# EAGLE schematic NT1X68BC (EAGLE 6.6.0)

## Sheet 1 of 5: I/O + Power
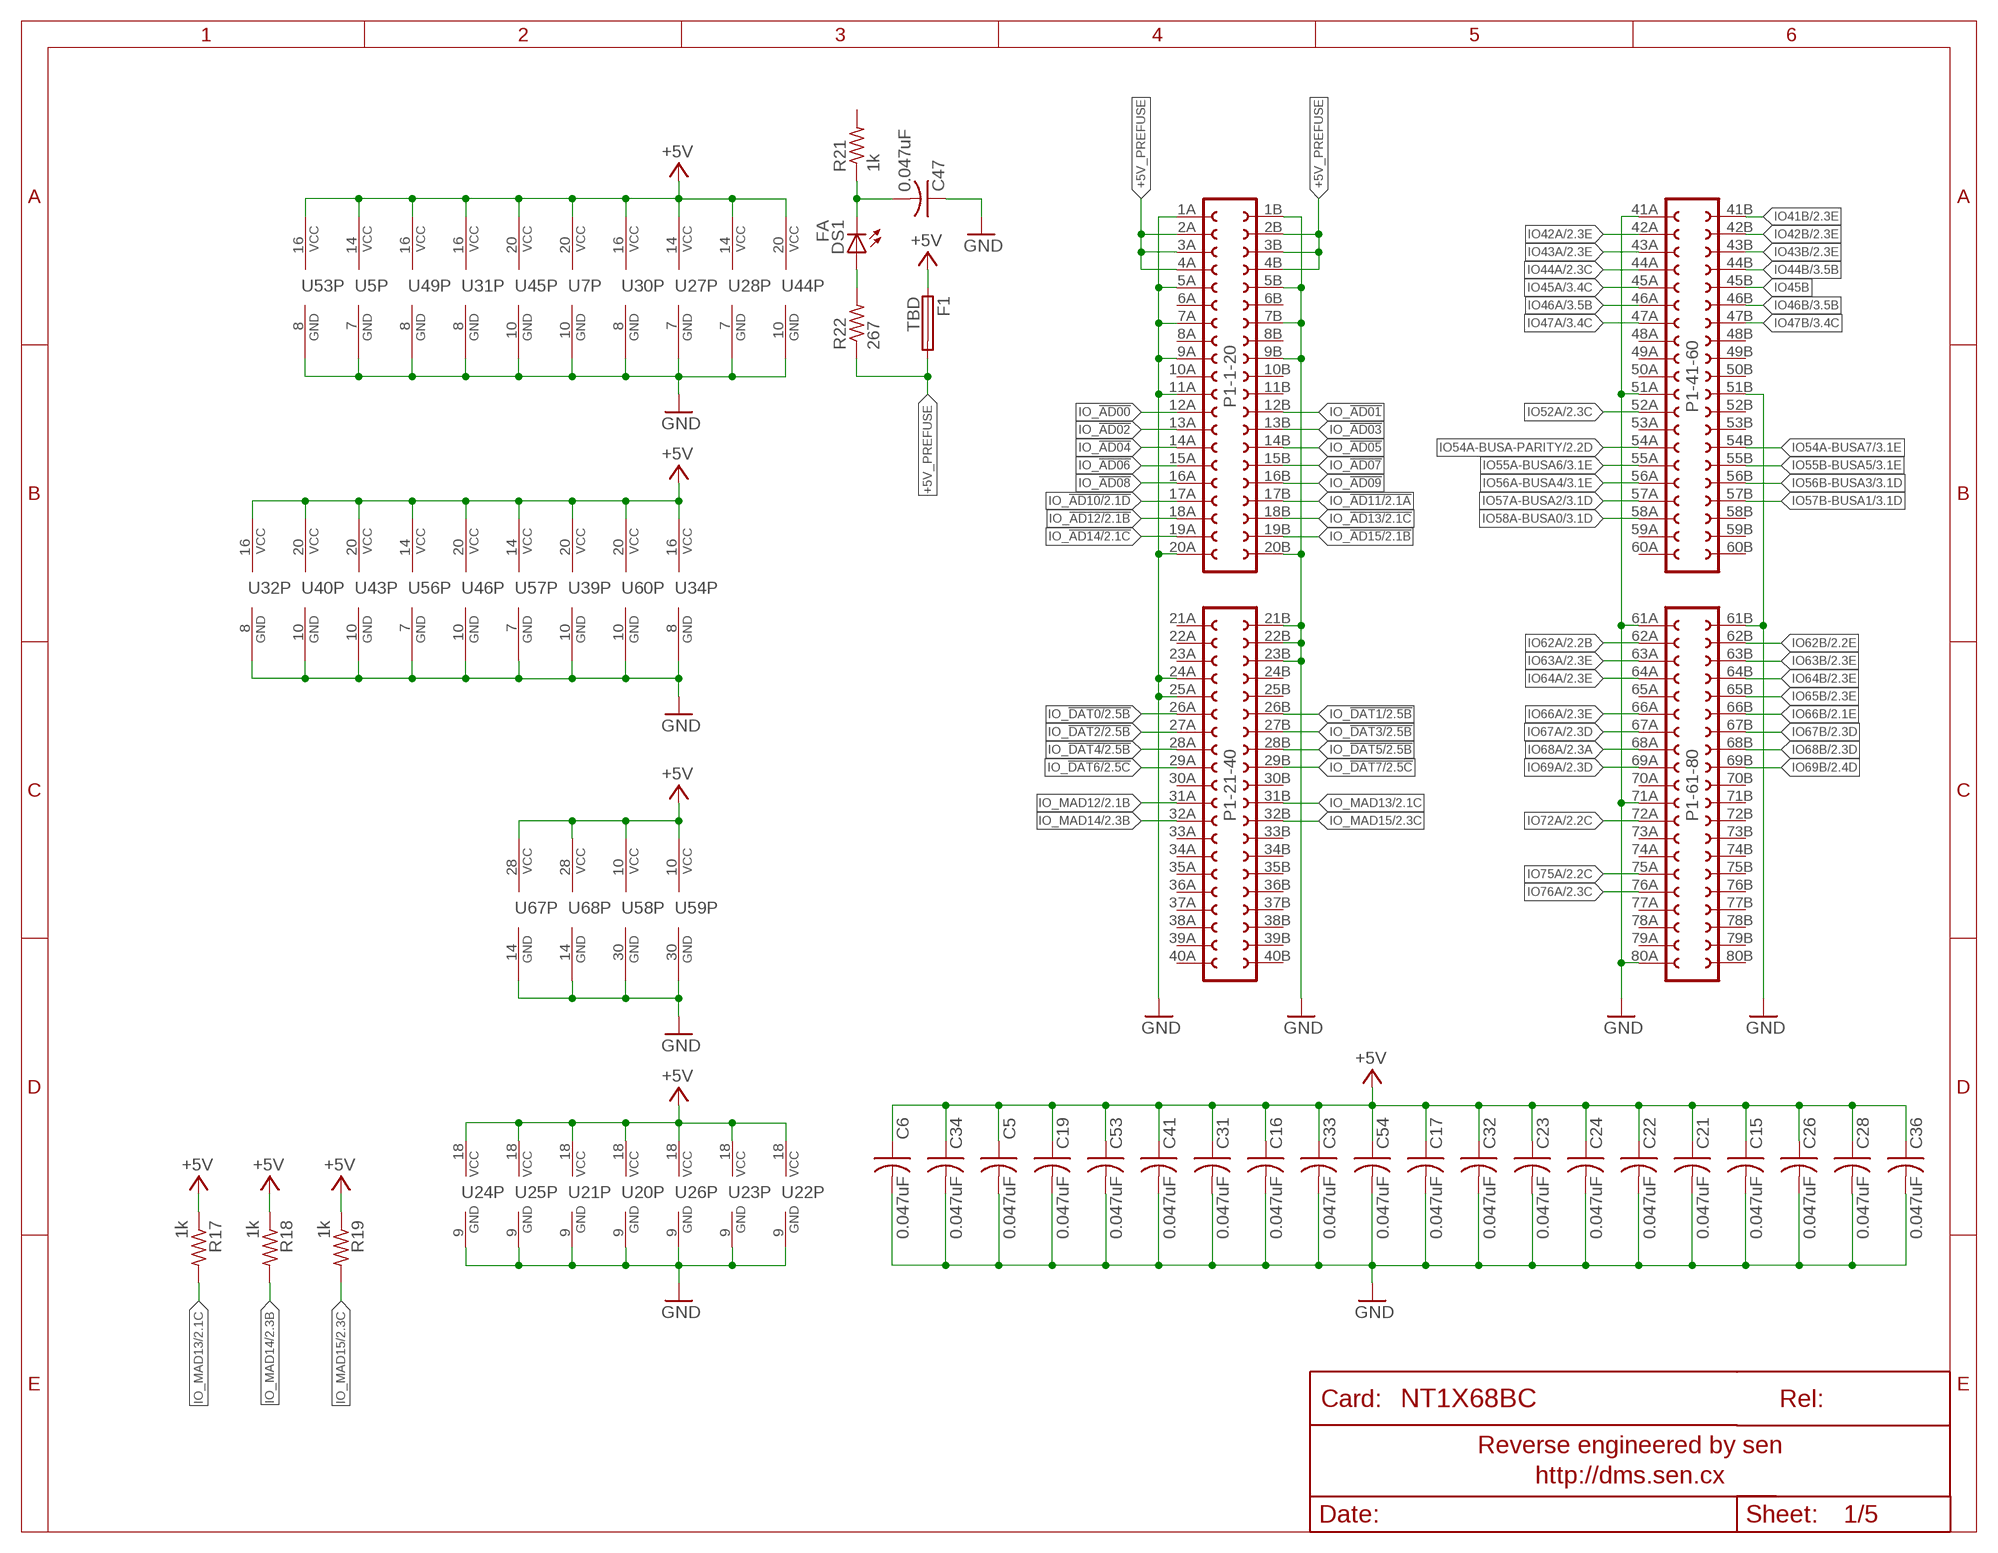
[diagram p0: schematic, sheet 1]
FRAME1 (FRAME-LETTER-GRID-DMS): REL: 04

### Parts
C5  0.047uF  C-US075-032X103  [C075-032X103]
C6  0.047uF  C-US075-032X103  [C075-032X103]
C15  0.047uF  C-US075-032X103  [C075-032X103]
C16  0.047uF  C-US075-032X103  [C075-032X103]
C17  0.047uF  C-US075-032X103  [C075-032X103]
C19  0.047uF  C-US075-032X103  [C075-032X103]
C21  0.047uF  C-US075-032X103  [C075-032X103]
C22  0.047uF  C-US075-032X103  [C075-032X103]
C23  0.047uF  C-US075-032X103  [C075-032X103]
C24  0.047uF  C-US075-032X103  [C075-032X103]
C26  0.047uF  C-US075-032X103  [C075-032X103]
C28  0.047uF  C-US075-032X103  [C075-032X103]
C31  0.047uF  C-US075-032X103  [C075-032X103]
C32  0.047uF  C-US075-032X103  [C075-032X103]
C33  0.047uF  C-US075-032X103  [C075-032X103]
C34  0.047uF  C-US075-032X103  [C075-032X103]
C36  0.047uF  C-US075-032X103  [C075-032X103]
C41  0.047uF  C-US075-032X103  [C075-032X103]
C47  0.047uF  C-US075-032X103  [C075-032X103]
C53  0.047uF  C-US075-032X103  [C075-032X103]
C54  0.047uF  C-US075-032X103  [C075-032X103]
DS1  FA  LED5MM  [LED5MM]
F1  TBD  LITTLEFUSE  [LITTLEFUSE]
P1  FE80-2W-HALFKEY  [FE80-2W-HALFKEY]
R17  1k  R-US_0207/12  [0207/12]
R18  1k  R-US_0207/12  [0207/12]
R19  1k  R-US_0207/12  [0207/12]
R21  1k  R-US_0207/12  [0207/12]
R22  267  R-US_0207/12  [0207/12]
U5  74LS14N  [DIL14]
U7  74LS374N  [DIL20]
U20  DM74S573  [DIL18]
U21  DM74S573  [DIL18]
U22  DM74S573  [DIL18]
U23  DM74S573  [DIL18]
U24  DM74S573  [DIL18]
U25  DM74S573  [DIL18]
U26  DM74S573  [DIL18]
U27  74LS136N  [DIL14]
U28  74LS136N  [DIL14]
U30  74LS257N  [DIL16]
U31  74LS257N  [DIL16]
U32  74LS257N  [DIL16]
U34  74LS257N  [DIL16]
U39  74LS374N  [DIL20]
U40  74LS374N  [DIL20]
U43  74LS240N  [DIL20]
U44  74LS240N  [DIL20]
U45  74LS240N  [DIL20]
U46  74LS240N  [DIL20]
U49  74LS109N  [DIL16]
U53  74LS138N  [DIL16]
U56  74F280N  74LS280N  [DIL14]
U57  74F280N  74LS280N  [DIL14]
U58  CY7C901  [DIL40]
U59  CY7C901  [DIL40]
U60  74LS241N  [DIL20]
U67  CY7C909  [DIL28-6]
U68  CY7C909  [DIL28-6]

### Nets
+5V: C5.1 C6.1 C15.1 C16.1 C17.1 C19.1 C21.1 C22.1 C23.1 C24.1 C26.1 C28.1 C31.1 C32.1 C33.1 C34.1 C36.1 C41.1 C53.1 C54.1 F1.1 R17.1 R18.1 R19.1 U5.14(P:VCC) U7.20(VCC) U20.18(VCC) U21.18(VCC) U22.18(VCC) U23.18(VCC) U24.18(VCC) U25.18(VCC) U26.18(VCC) U27.14(P:VCC) U28.14(P:VCC) U30.16(VCC) U31.16(VCC) U32.16(VCC) U34.16(VCC) U39.20(VCC) U40.20(VCC) U43.20(P:VCC) U44.20(P:VCC) U45.20(P:VCC) U46.20(P:VCC) U49.16(P:VCC) U53.16(VCC) U56.14(VCC) U57.14(VCC) U58.10(VCC) U59.10(VCC) U60.20(P:VCC) U67.28(VCC) U68.28(VCC) ; also sheet 2,4
+5V_PREFUSE: F1.2 P1.2A(-1-20:2A) P1.2B(-1-20:2B) P1.3A(-1-20:3A) P1.3B(-1-20:3B) P1.4A(-1-20:4A) P1.4B(-1-20:4B) R22.1
DS1-R21: C47.2 DS1.K(C) R21.1
GND: C5.2 C6.2 C15.2 C16.2 C17.2 C19.2 C21.2 C22.2 C23.2 C24.2 C26.2 C28.2 C31.2 C32.2 C33.2 C34.2 C36.2 C41.2 C47.1 C53.2 C54.2 P1.1A(-1-20:1A) P1.1B(-1-20:1B) P1.5A(-1-20:5A) P1.5B(-1-20:5B) P1.7A(-1-20:7A) P1.7B(-1-20:7B) P1.9A(-1-20:9A) P1.9B(-1-20:9B) P1.11A(-1-20:11A) P1.20A(-1-20:20A) P1.20B(-1-20:20B) P1.21B(-21-40:1B) P1.22B(-21-40:2B) P1.23B(-21-40:3B) P1.24A(-21-40:4A) P1.25A(-21-40:5A) P1.41A(-41-60:1A) P1.51A(-41-60:11A) P1.51B(-41-60:11B) P1.61A(-61-80:1A) P1.61B(-61-80:1B) P1.71A(-61-80:11A) P1.80A(-61-80:20A) U5.7(P:GND) U7.10(GND) U20.9(GND) U21.9(GND) U22.9(GND) U23.9(GND) U24.9(GND) U25.9(GND) U26.9(GND) U27.7(P:GND) U28.7(P:GND) U30.8(GND) U31.8(GND) U32.8(GND) U34.8(GND) U39.10(GND) U40.10(GND) U43.10(P:GND) U44.10(P:GND) U45.10(P:GND) U46.10(P:GND) U49.8(P:GND) U53.8(GND) U56.7(GND) U57.7(GND) U58.30(GND) U59.30(GND) U60.10(P:GND) U67.14(GND) U68.14(GND) ; also sheet 2,3,4,5
IO41B: P1.41B(-41-60:1B) ; also sheet 2
IO42A: P1.42A(-41-60:2A) ; also sheet 2
IO42B: P1.42B(-41-60:2B) ; also sheet 2
IO43A: P1.43A(-41-60:3A) ; also sheet 2
IO43B: P1.43B(-41-60:3B) ; also sheet 2
IO44A: P1.44A(-41-60:4A) ; also sheet 2
IO44B: P1.44B(-41-60:4B) ; also sheet 3
IO45A: P1.45A(-41-60:5A) ; also sheet 3
IO45B: P1.45B(-41-60:5B)
IO46A: P1.46A(-41-60:6A) ; also sheet 3
IO46B: P1.46B(-41-60:6B) ; also sheet 3
IO47A: P1.47A(-41-60:7A) ; also sheet 3
IO47B: P1.47B(-41-60:7B) ; also sheet 3
IO52A: P1.52A(-41-60:12A) ; also sheet 2
IO54A-BUSA7: P1.54B(-41-60:14B) ; also sheet 3
IO54A-BUSA-PARITY: P1.54A(-41-60:14A) ; also sheet 2,3
IO55A-BUSA6: P1.55A(-41-60:15A) ; also sheet 3
IO55B-BUSA5: P1.55B(-41-60:15B) ; also sheet 3
IO56A-BUSA4: P1.56A(-41-60:16A) ; also sheet 3
IO56B-BUSA3: P1.56B(-41-60:16B) ; also sheet 3
IO57A-BUSA2: P1.57A(-41-60:17A) ; also sheet 3
IO57B-BUSA1: P1.57B(-41-60:17B) ; also sheet 3
IO58A-BUSA0: P1.58A(-41-60:18A) ; also sheet 3
IO62A: P1.62A(-61-80:2A) ; also sheet 2
IO62B: P1.62B(-61-80:2B) ; also sheet 2
IO63A: P1.63A(-61-80:3A) ; also sheet 2,3
IO63B: P1.63B(-61-80:3B) ; also sheet 2,3
IO64A: P1.64A(-61-80:4A) ; also sheet 2,3
IO64B: P1.64B(-61-80:4B) ; also sheet 2,3
IO65B: P1.65B(-61-80:5B) ; also sheet 2,3
IO66A: P1.66A(-61-80:6A) ; also sheet 2,3
IO66B: P1.66B(-61-80:6B) ; also sheet 2,3
IO67A: P1.67A(-61-80:7A) ; also sheet 2
IO67B: P1.67B(-61-80:7B) ; also sheet 2
IO68A: P1.68A(-61-80:8A) ; also sheet 2
IO68B: P1.68B(-61-80:8B) ; also sheet 2
IO69A: P1.69A(-61-80:9A) ; also sheet 2
IO69B: P1.69B(-61-80:9B) ; also sheet 2
IO72A: P1.72A(-61-80:12A) ; also sheet 2
IO75A: P1.75A(-61-80:15A) ; also sheet 2
IO76A: P1.76A(-61-80:16A) ; also sheet 2
IO_!AD00: P1.12A(-1-20:12A)
IO_!AD01: P1.12B(-1-20:12B)
IO_!AD02: P1.13A(-1-20:13A)
IO_!AD03: P1.13B(-1-20:13B)
IO_!AD04: P1.14A(-1-20:14A)
IO_!AD05: P1.14B(-1-20:14B)
IO_!AD06: P1.15A(-1-20:15A)
IO_!AD07: P1.15B(-1-20:15B)
IO_!AD08: P1.16A(-1-20:16A)
IO_!AD09: P1.16B(-1-20:16B)
IO_!AD10: P1.17A(-1-20:17A) ; also sheet 2
IO_!AD11: P1.17B(-1-20:17B) ; also sheet 2
IO_!AD12: P1.18A(-1-20:18A) ; also sheet 2
IO_!AD13: P1.18B(-1-20:18B) ; also sheet 2
IO_!AD14: P1.19A(-1-20:19A) ; also sheet 2
IO_!AD15: P1.19B(-1-20:19B) ; also sheet 2
IO_!DAT0: P1.26A(-21-40:6A) ; also sheet 2
IO_!DAT1: P1.26B(-21-40:6B) ; also sheet 2
IO_!DAT2: P1.27A(-21-40:7A) ; also sheet 2
IO_!DAT3: P1.27B(-21-40:7B) ; also sheet 2
IO_!DAT4: P1.28A(-21-40:8A) ; also sheet 2
IO_!DAT5: P1.28B(-21-40:8B) ; also sheet 2
IO_!DAT6: P1.29A(-21-40:9A) ; also sheet 2
IO_!DAT7: P1.29B(-21-40:9B) ; also sheet 2
IO_MAD12: P1.31A(-21-40:11A) ; also sheet 2
IO_MAD13: P1.31B(-21-40:11B) R17.2 ; also sheet 2
IO_MAD14: P1.32A(-21-40:12A) R18.2 ; also sheet 2
IO_MAD15: P1.32B(-21-40:12B) R19.2 ; also sheet 2
R22_DS1: DS1.A R22.2
Unconnected: P1.6A(-1-20:6A) P1.6B(-1-20:6B) P1.8A(-1-20:8A) P1.8B(-1-20:8B) P1.10A(-1-20:10A) P1.10B(-1-20:10B) P1.11B(-1-20:11B) P1.21A(-21-40:1A) P1.22A(-21-40:2A) P1.23A(-21-40:3A) P1.24B(-21-40:4B) P1.25B(-21-40:5B) P1.30A(-21-40:10A) P1.30B(-21-40:10B) P1.33A(-21-40:13A) P1.33B(-21-40:13B) P1.34A(-21-40:14A) P1.34B(-21-40:14B) P1.35A(-21-40:15A) P1.35B(-21-40:15B) P1.36A(-21-40:16A) P1.36B(-21-40:16B) P1.37A(-21-40:17A) P1.37B(-21-40:17B) P1.38A(-21-40:18A) P1.38B(-21-40:18B) P1.39A(-21-40:19A) P1.39B(-21-40:19B) P1.40A(-21-40:20A) P1.40B(-21-40:20B) P1.48A(-41-60:8A) P1.48B(-41-60:8B) P1.49A(-41-60:9A) P1.49B(-41-60:9B) P1.50A(-41-60:10A) P1.50B(-41-60:10B) P1.52B(-41-60:12B) P1.53A(-41-60:13A) P1.53B(-41-60:13B) P1.58B(-41-60:18B) P1.59A(-41-60:19A) P1.59B(-41-60:19B) P1.60A(-41-60:20A) P1.60B(-41-60:20B) P1.65A(-61-80:5A) P1.70A(-61-80:10A) P1.70B(-61-80:10B) P1.71B(-61-80:11B) P1.72B(-61-80:12B) P1.73A(-61-80:13A) P1.73B(-61-80:13B) P1.74A(-61-80:14A) P1.74B(-61-80:14B) P1.75B(-61-80:15B) P1.76B(-61-80:16B) P1.77A(-61-80:17A) P1.77B(-61-80:17B) P1.78A(-61-80:18A) P1.78B(-61-80:18B) P1.79A(-61-80:19A) P1.79B(-61-80:19B) P1.80B(-61-80:20B) R21.2 U27.8(C:O) U27.9(C:I0) U27.10(C:I1) U27.11(D:O) U27.12(D:I0) U27.13(D:I1)

## Sheet 2 of 5: Logic 1
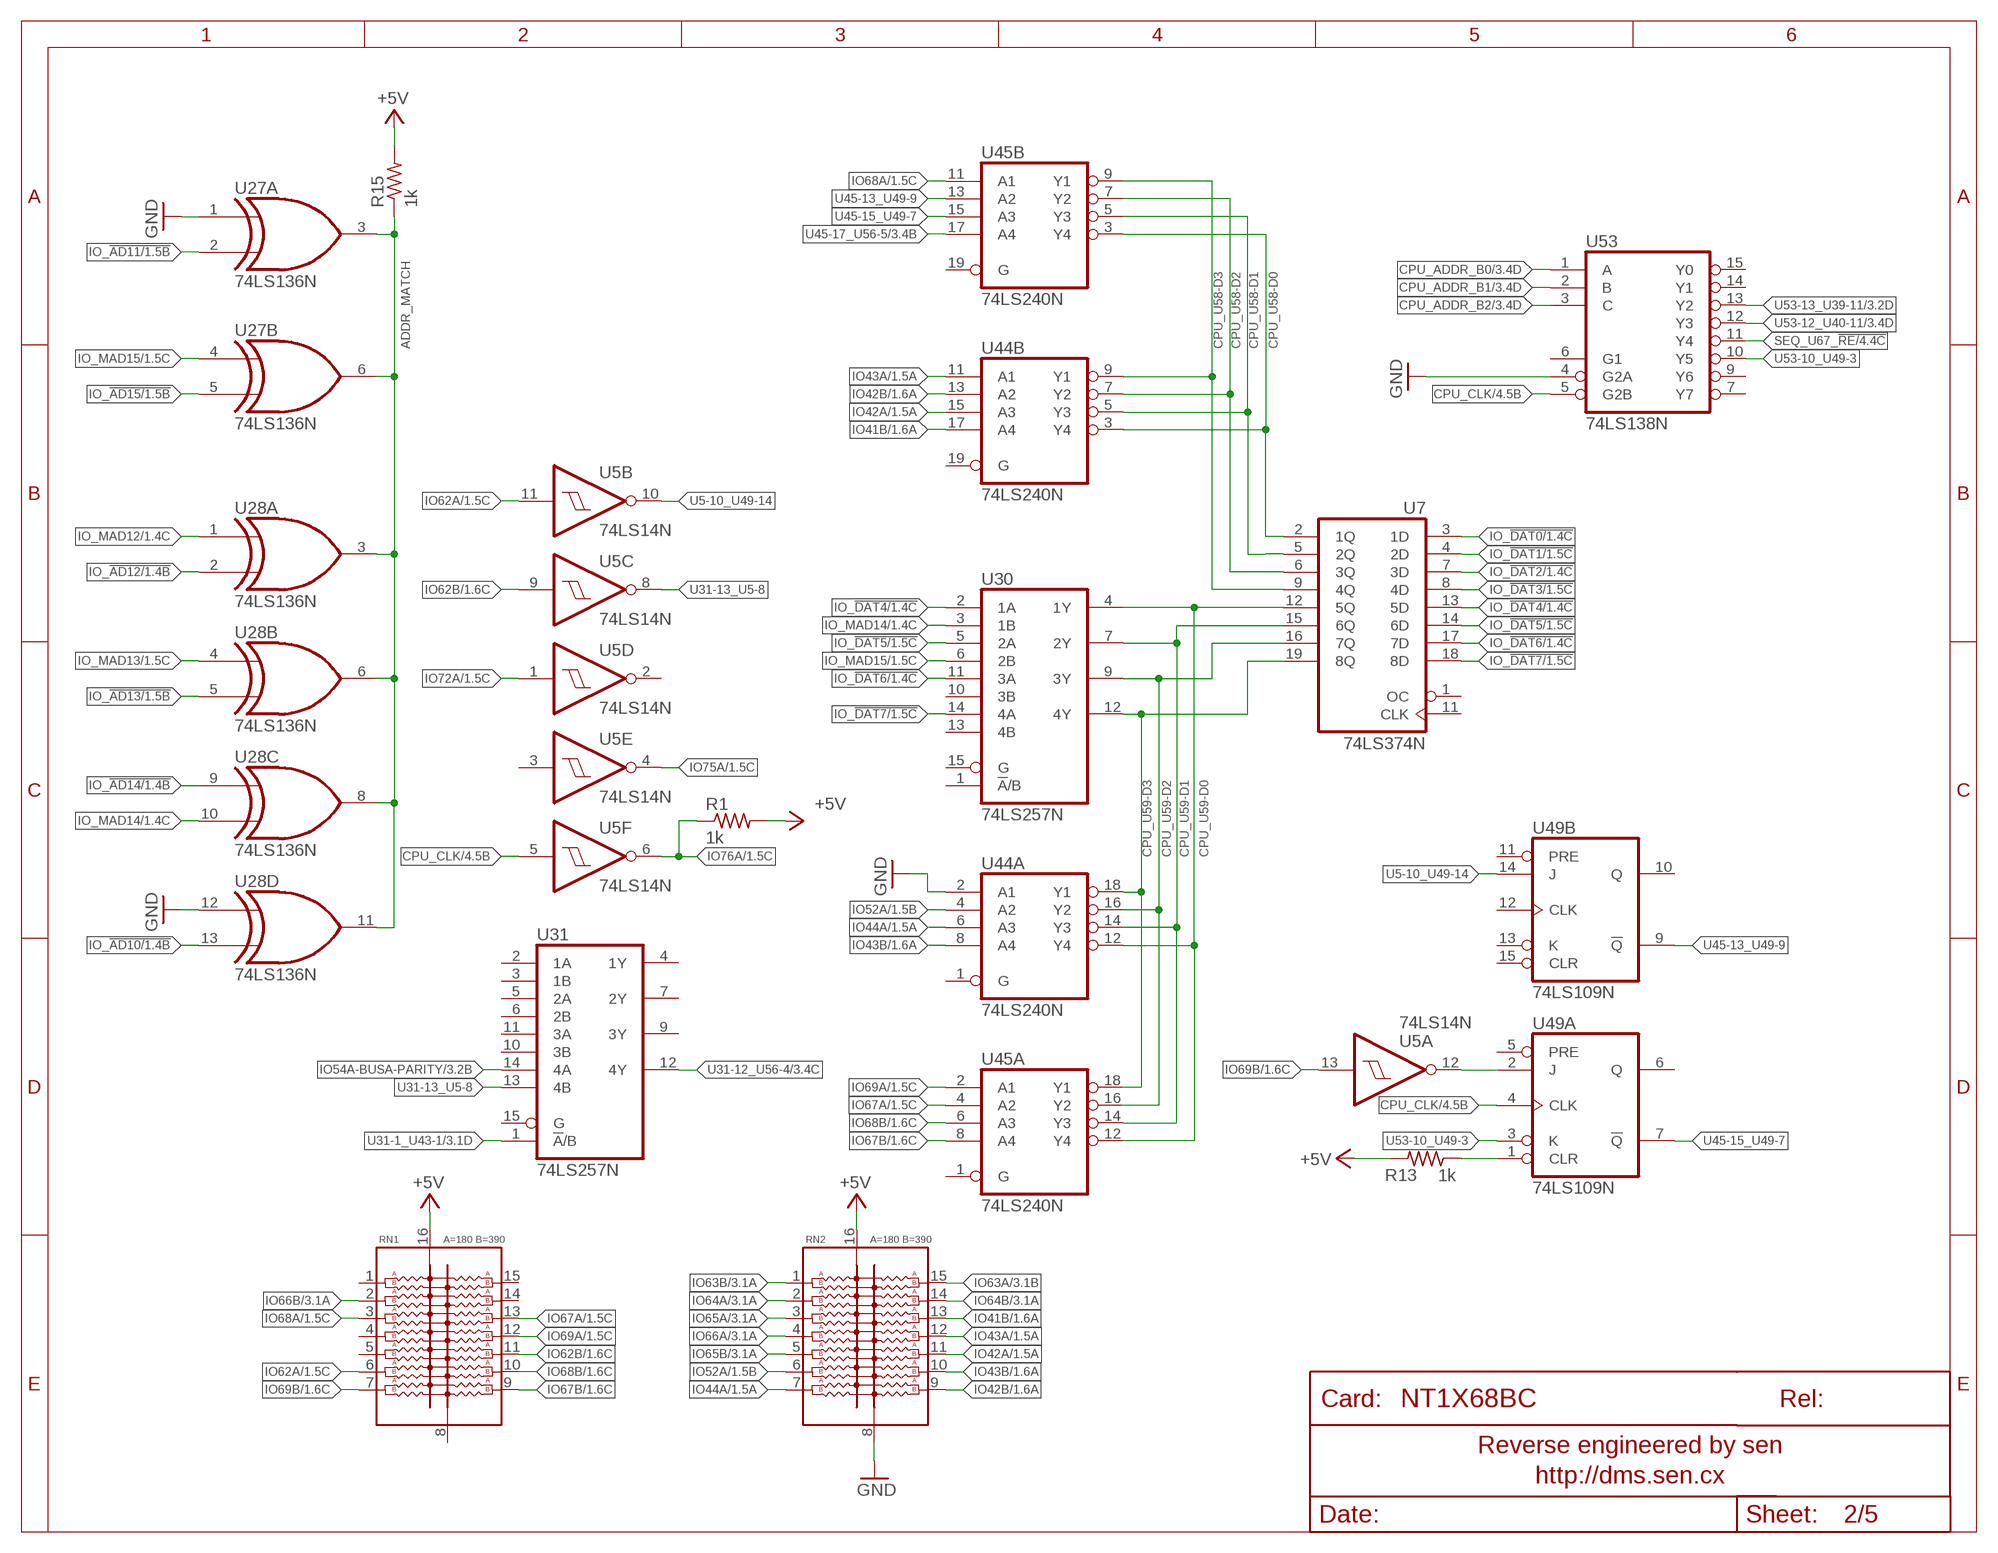
[diagram p1: schematic, sheet 2]
FRAME2 (FRAME-LETTER-GRID-DMS): REL: 04

### Parts
R1  1k  R-US_0207/12  [0207/12]
R13  1k  R-US_0207/12  [0207/12]
R15  1k  R-US_0207/12  [0207/12]
RN1  A=180 B=390  DALE-MDP1605  [DIL16]
RN2  A=180 B=390  DALE-MDP1605  [DIL16]

### Nets
+5V: R1.2 R13.2 R15.2 RN1.16(A) RN2.16(A) ; also sheet 1,4
ADDR_MATCH: R15.1 U27.3(A:O) U27.6(B:O) U28.3(A:O) U28.6(B:O) U28.8(C:O) U28.11(D:O)
CPU_ADDR_B0: U53.1(A) ; also sheet 3,4
CPU_ADDR_B1: U53.2(B) ; also sheet 3,4
CPU_ADDR_B2: U53.3(C) ; also sheet 3,4
CPU_CLK: U5.5(F:I) U49.4(A:CLK) U53.5(G2B) ; also sheet 4
CPU_U58-D0: U7.2(1Q) U44.3(B:Y4) U45.3(B:Y4) ; also sheet 3,4
CPU_U58-D1: U7.5(2Q) U44.5(B:Y3) U45.5(B:Y3) ; also sheet 3,4
CPU_U58-D2: U7.6(3Q) U44.7(B:Y2) U45.7(B:Y2) ; also sheet 3,4
CPU_U58-D3: U7.9(4Q) U44.9(B:Y1) U45.9(B:Y1) ; also sheet 3,4
CPU_U59-D0: U7.12(5Q) U30.4(1Y) U44.12(A:Y4) U45.12(A:Y4) ; also sheet 4
CPU_U59-D1: U7.15(6Q) U30.7(2Y) U44.14(A:Y3) U45.14(A:Y3) ; also sheet 4
CPU_U59-D2: U7.16(7Q) U30.9(3Y) U44.16(A:Y2) U45.16(A:Y2) ; also sheet 4
CPU_U59-D3: U7.19(8Q) U30.12(4Y) U44.18(A:Y1) U45.18(A:Y1) ; also sheet 4
GND: RN2.8(B) U27.1(A:I0) U28.12(D:I0) U44.2(A:A1) U53.4(G2A) ; also sheet 1,3,4,5
IO41B: RN2.13(R12) U44.17(B:A4) ; also sheet 1
IO42A: RN2.11(R10) U44.15(B:A3) ; also sheet 1
IO42B: RN2.9(R8) U44.13(B:A2) ; also sheet 1
IO43A: RN2.12(R11) U44.11(B:A1) ; also sheet 1
IO43B: RN2.10(R9) U44.8(A:A4) ; also sheet 1
IO44A: RN2.7(R7) U44.6(A:A3) ; also sheet 1
IO52A: RN2.6(R6) U44.4(A:A2) ; also sheet 1
IO54A-BUSA-PARITY: U31.14(4A) ; also sheet 1,3
IO62A: RN1.6(R6) U5.11(B:I) ; also sheet 1
IO62B: RN1.11(R10) U5.9(C:I) ; also sheet 1
IO63A: RN2.15(R14) ; also sheet 1,3
IO63B: RN2.1(R1) ; also sheet 1,3
IO64A: RN2.2(R2) ; also sheet 1,3
IO64B: RN2.14(R13) ; also sheet 1,3
IO65A: RN2.3(R3) ; also sheet 3
IO65B: RN2.5(R5) ; also sheet 1,3
IO66A: RN2.4(R4) ; also sheet 1,3
IO66B: RN1.2(R2) ; also sheet 1,3
IO67A: RN1.13(R12) U45.4(A:A2) ; also sheet 1
IO67B: RN1.9(R8) U45.8(A:A4) ; also sheet 1
IO68A: RN1.3(R3) U45.11(B:A1) ; also sheet 1
IO68B: RN1.10(R9) U45.6(A:A3) ; also sheet 1
IO69A: RN1.12(R11) U45.2(A:A1) ; also sheet 1
IO69B: RN1.7(R7) U5.13(A:I) ; also sheet 1
IO72A: U5.1(D:I) ; also sheet 1
IO75A: U5.4(E:O) ; also sheet 1
IO76A: R1.1 U5.6(F:O) ; also sheet 1
IO_!AD10: U28.13(D:I1) ; also sheet 1
IO_!AD11: U27.2(A:I1) ; also sheet 1
IO_!AD12: U28.2(A:I1) ; also sheet 1
IO_!AD13: U28.5(B:I1) ; also sheet 1
IO_!AD14: U28.9(C:I0) ; also sheet 1
IO_!AD15: U27.5(B:I1) ; also sheet 1
IO_!DAT0: U7.3(1D) ; also sheet 1
IO_!DAT1: U7.4(2D) ; also sheet 1
IO_!DAT2: U7.7(3D) ; also sheet 1
IO_!DAT3: U7.8(4D) ; also sheet 1
IO_!DAT4: U7.13(5D) U30.2(1A) ; also sheet 1
IO_!DAT5: U7.14(6D) U30.5(2A) ; also sheet 1
IO_!DAT6: U7.17(7D) U30.11(3A) ; also sheet 1
IO_!DAT7: U7.18(8D) U30.14(4A) ; also sheet 1
IO_MAD12: U28.1(A:I0) ; also sheet 1
IO_MAD13: U28.4(B:I0) ; also sheet 1
IO_MAD14: U28.10(C:I1) U30.3(1B) ; also sheet 1
IO_MAD15: U27.4(B:I0) U30.6(2B) ; also sheet 1
N$2: R13.1 U49.1(A:CLR)
SEQ_U67_!RE: U53.11(Y4) ; also sheet 4
U5-10_U49-14: U5.10(B:O) U49.14(B:J)
U5-12_U49-2: U5.12(A:O) U49.2(A:J)
U31-1_U43-1: U31.1(!A!/B) ; also sheet 3
U31-12_U56-4: U31.12(4Y) ; also sheet 3
U31-13_U5-8: U5.8(C:O) U31.13(4B)
U45-13_U49-9: U45.13(B:A2) U49.9(B:!Q)
U45-15_U49-7: U45.15(B:A3) U49.7(A:!Q)
U45-17_U56-5: U45.17(B:A4) ; also sheet 3
U53-10_U49-3: U49.3(A:K) U53.10(Y5)
U53-12_U40-11: U53.12(Y3) ; also sheet 3
U53-13_U39-11: U53.13(Y2) ; also sheet 3
Unconnected: RN1.1(R1) RN1.4(R4) RN1.5(R5) RN1.8(B) RN1.14(R13) RN1.15(R14) U5.2(D:O) U5.3(E:I) U7.1(OC) U7.11(CLK) U30.1(!A!/B) U30.10(3B) U30.13(4B) U30.15(G) U31.2(1A) U31.3(1B) U31.4(1Y) U31.5(2A) U31.6(2B) U31.7(2Y) U31.9(3Y) U31.10(3B) U31.11(3A) U31.15(G) U44.1(A:G) U44.19(B:G) U45.1(A:G) U45.19(B:G) U49.5(A:PRE) U49.6(A:Q) U49.10(B:Q) U49.11(B:PRE) U49.12(B:CLK) U49.13(B:K) U49.15(B:CLR) U53.6(G1) U53.7(Y7) U53.9(Y6) U53.14(Y1) U53.15(Y0)

## Sheet 3 of 5: Logic 2
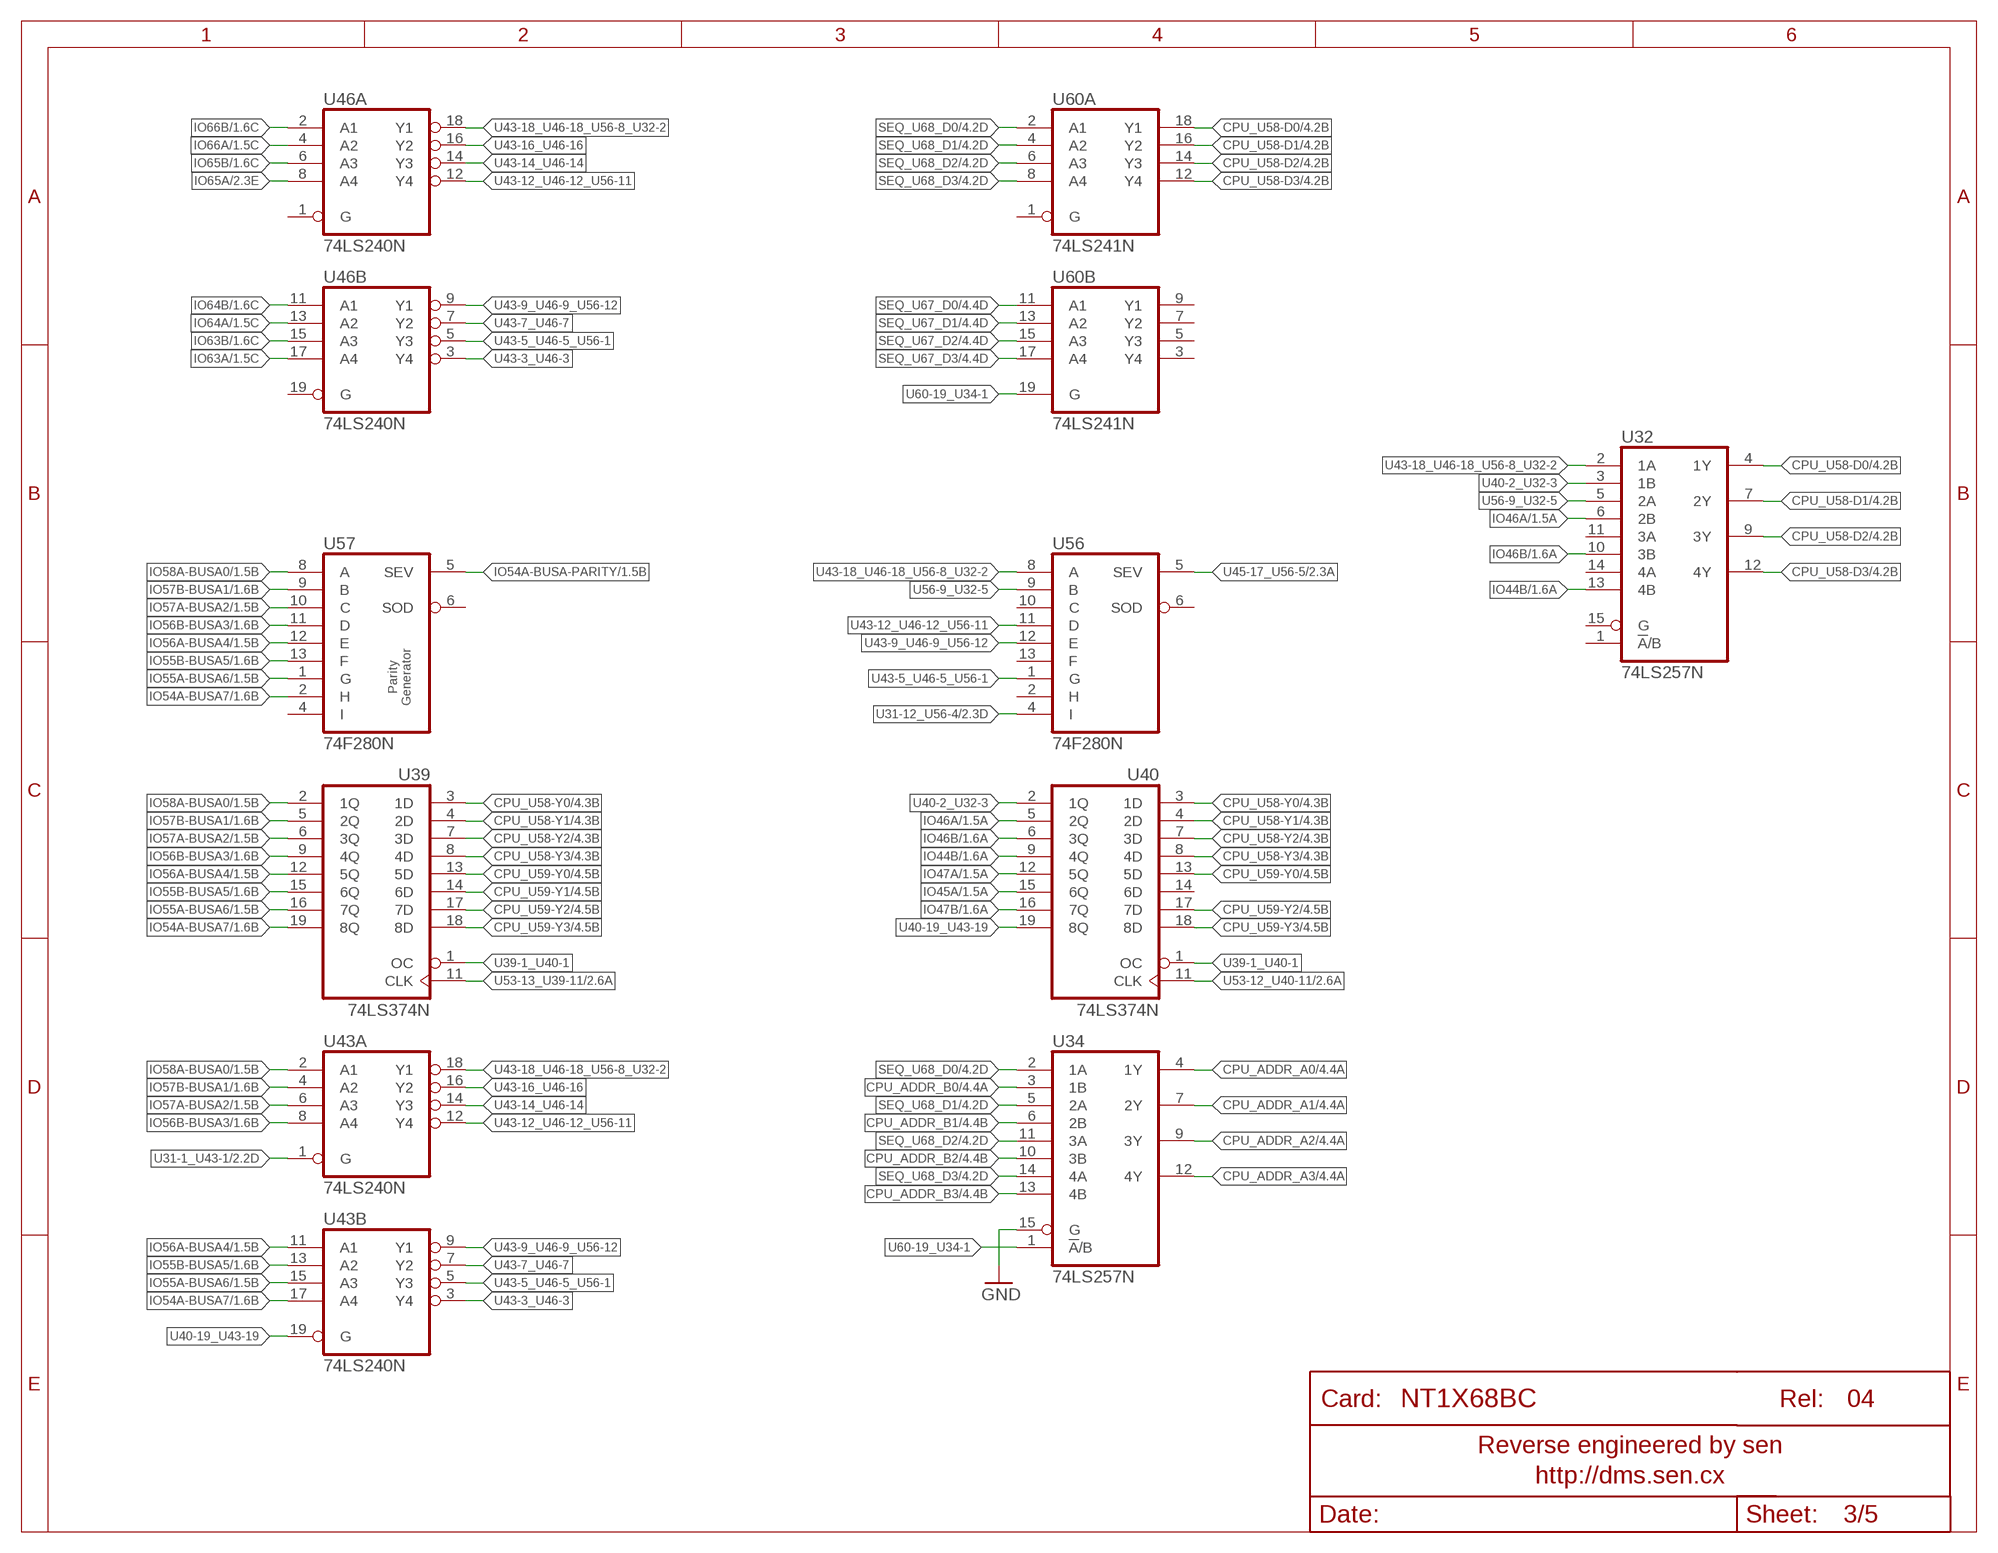
[diagram p2: schematic, sheet 3]
FRAME4 (FRAME-LETTER-GRID-DMS): REL: 04

### Nets
CPU_ADDR_A0: U34.4(1Y) ; also sheet 4
CPU_ADDR_A1: U34.7(2Y) ; also sheet 4
CPU_ADDR_A2: U34.9(3Y) ; also sheet 4
CPU_ADDR_A3: U34.12(4Y) ; also sheet 4
CPU_ADDR_B0: U34.3(1B) ; also sheet 2,4
CPU_ADDR_B1: U34.6(2B) ; also sheet 2,4
CPU_ADDR_B2: U34.10(3B) ; also sheet 2,4
CPU_ADDR_B3: U34.13(4B) ; also sheet 4
CPU_U58-D0: U32.4(1Y) U60.18(A:Y1) ; also sheet 2,4
CPU_U58-D1: U32.7(2Y) U60.16(A:Y2) ; also sheet 2,4
CPU_U58-D2: U32.9(3Y) U60.14(A:Y3) ; also sheet 2,4
CPU_U58-D3: U32.12(4Y) U60.12(A:Y4) ; also sheet 2,4
CPU_U58-Y0: U39.3(1D) U40.3(1D) ; also sheet 4
CPU_U58-Y1: U39.4(2D) U40.4(2D) ; also sheet 4
CPU_U58-Y2: U39.7(3D) U40.7(3D) ; also sheet 4
CPU_U58-Y3: U39.8(4D) U40.8(4D) ; also sheet 4
CPU_U59-Y0: U39.13(5D) U40.13(5D) ; also sheet 4
CPU_U59-Y1: U39.14(6D) ; also sheet 4
CPU_U59-Y2: U39.17(7D) U40.17(7D) ; also sheet 4
CPU_U59-Y3: U39.18(8D) U40.18(8D) ; also sheet 4
GND: U34.15(G) ; also sheet 1,2,4,5
IO44B: U32.13(4B) U40.9(4Q) ; also sheet 1
IO45A: U40.15(6Q) ; also sheet 1
IO46A: U32.6(2B) U40.5(2Q) ; also sheet 1
IO46B: U32.10(3B) U40.6(3Q) ; also sheet 1
IO47A: U40.12(5Q) ; also sheet 1
IO47B: U40.16(7Q) ; also sheet 1
IO54A-BUSA7: U39.19(8Q) U43.17(B:A4) U57.2(H) ; also sheet 1
IO54A-BUSA-PARITY: U57.5(SEV) ; also sheet 1,2
IO55A-BUSA6: U39.16(7Q) U43.15(B:A3) U57.1(G) ; also sheet 1
IO55B-BUSA5: U39.15(6Q) U43.13(B:A2) U57.13(F) ; also sheet 1
IO56A-BUSA4: U39.12(5Q) U43.11(B:A1) U57.12(E) ; also sheet 1
IO56B-BUSA3: U39.9(4Q) U43.8(A:A4) U57.11(D) ; also sheet 1
IO57A-BUSA2: U39.6(3Q) U43.6(A:A3) U57.10(C) ; also sheet 1
IO57B-BUSA1: U39.5(2Q) U43.4(A:A2) U57.9(B) ; also sheet 1
IO58A-BUSA0: U39.2(1Q) U43.2(A:A1) U57.8(A) ; also sheet 1
IO63A: U46.17(B:A4) ; also sheet 1,2
IO63B: U46.15(B:A3) ; also sheet 1,2
IO64A: U46.13(B:A2) ; also sheet 1,2
IO64B: U46.11(B:A1) ; also sheet 1,2
IO65A: U46.8(A:A4) ; also sheet 2
IO65B: U46.6(A:A3) ; also sheet 1,2
IO66A: U46.4(A:A2) ; also sheet 1,2
IO66B: U46.2(A:A1) ; also sheet 1,2
SEQ_U67_D0: U60.11(B:A1) ; also sheet 4
SEQ_U67_D1: U60.13(B:A2) ; also sheet 4
SEQ_U67_D2: U60.15(B:A3) ; also sheet 4
SEQ_U67_D3: U60.17(B:A4) ; also sheet 4
SEQ_U68_D0: U34.2(1A) U60.2(A:A1) ; also sheet 4
SEQ_U68_D1: U34.5(2A) U60.4(A:A2) ; also sheet 4
SEQ_U68_D2: U34.11(3A) U60.6(A:A3) ; also sheet 4
SEQ_U68_D3: U34.14(4A) U60.8(A:A4) ; also sheet 4
U31-1_U43-1: U43.1(A:G) ; also sheet 2
U31-12_U56-4: U56.4(I) ; also sheet 2
U39-1_U40-1: U39.1(OC) U40.1(OC)
U40-2_U32-3: U32.3(1B) U40.2(1Q)
U40-19_U43-19: U40.19(8Q) U43.19(B:G)
U43-3_U46-3: U43.3(B:Y4) U46.3(B:Y4)
U43-5_U46-5_U56-1: U43.5(B:Y3) U46.5(B:Y3) U56.1(G)
U43-7_U46-7: U43.7(B:Y2) U46.7(B:Y2)
U43-9_U46-9_U56-12: U43.9(B:Y1) U46.9(B:Y1) U56.12(E)
U43-12_U46-12_U56-11: U43.12(A:Y4) U46.12(A:Y4) U56.11(D)
U43-14_U46-14: U43.14(A:Y3) U46.14(A:Y3)
U43-16_U46-16: U43.16(A:Y2) U46.16(A:Y2)
U43-18_U46-18_U56-8_U32-2: U32.2(1A) U43.18(A:Y1) U46.18(A:Y1) U56.8(A)
U45-17_U56-5: U56.5(SEV) ; also sheet 2
U53-12_U40-11: U40.11(CLK) ; also sheet 2
U53-13_U39-11: U39.11(CLK) ; also sheet 2
U56-9_U32-5: U32.5(2A) U56.9(B)
U60-19_U34-1: U34.1(!A!/B) U60.19(B:G)
Unconnected: U32.1(!A!/B) U32.11(3A) U32.14(4A) U32.15(G) U40.14(6D) U46.1(A:G) U46.19(B:G) U56.2(H) U56.6(SOD) U56.10(C) U56.13(F) U57.4(I) U57.6(SOD) U60.1(A:G) U60.3(B:Y4) U60.5(B:Y3) U60.7(B:Y2) U60.9(B:Y1)

### Notes on the sheet
- Parity
  Generator

## Sheet 4 of 5: Processor
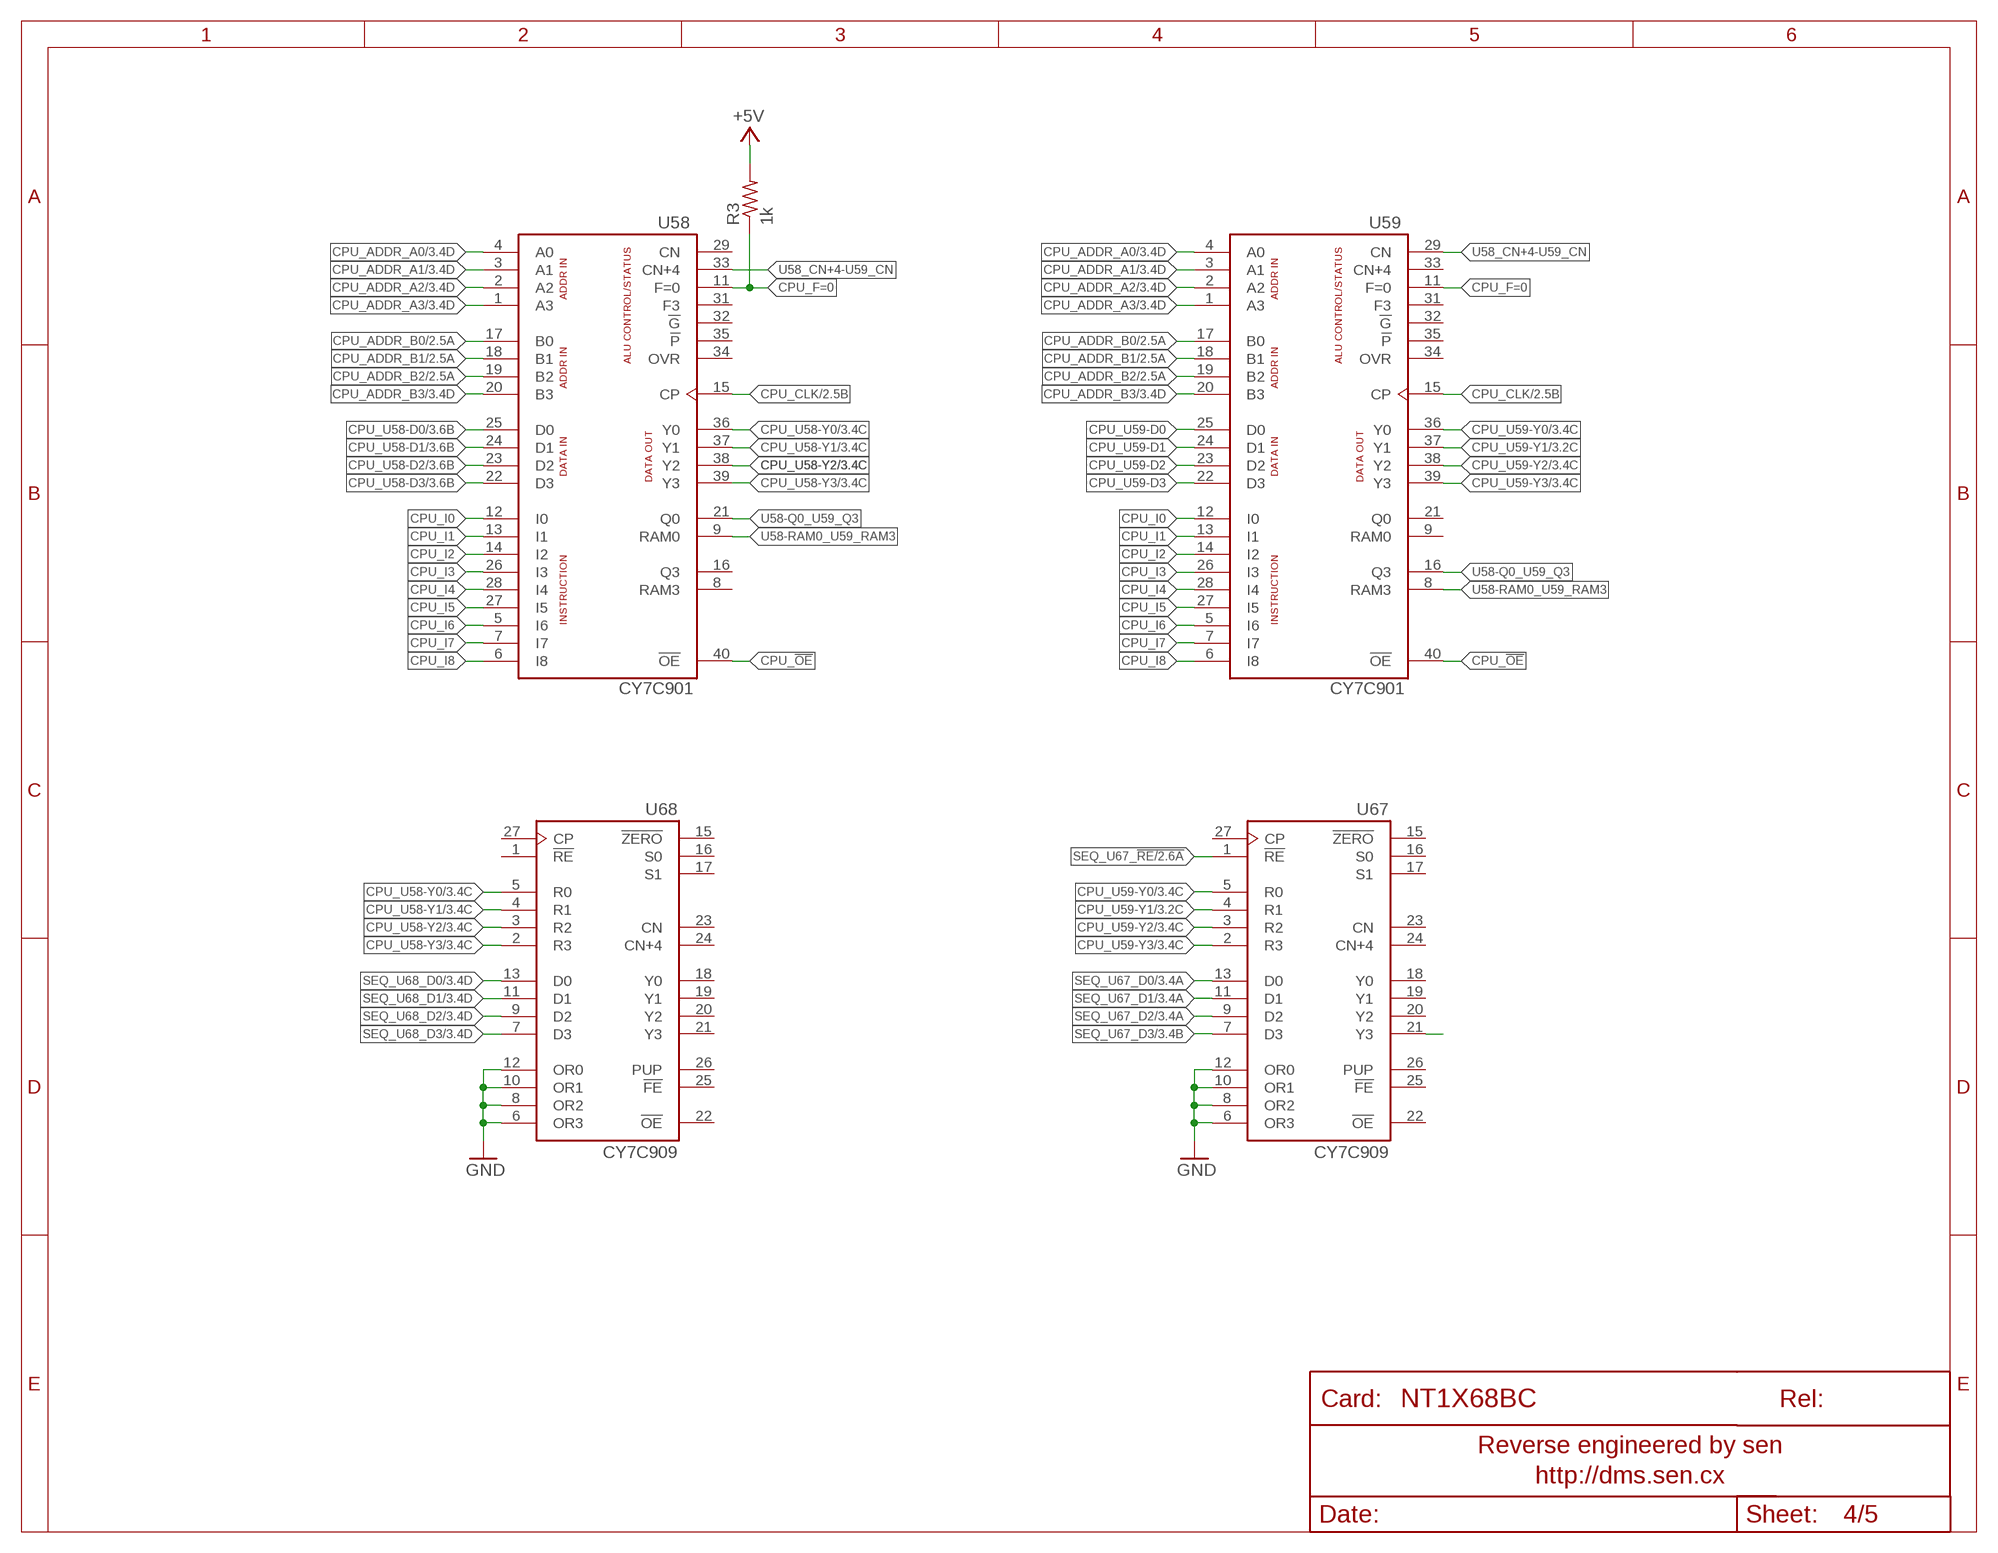
[diagram p3: schematic, sheet 4]
FRAME3 (FRAME-LETTER-GRID-DMS): REL: 04

### Parts
R3  1k  R-US_0207/12  [0207/12]

### Nets
+5V: R3.2 ; also sheet 1,2
CPU_!OE: U58.40(!OE) U59.40(!OE)
CPU_ADDR_A0: U58.4(A0) U59.4(A0) ; also sheet 3
CPU_ADDR_A1: U58.3(A1) U59.3(A1) ; also sheet 3
CPU_ADDR_A2: U58.2(A2) U59.2(A2) ; also sheet 3
CPU_ADDR_A3: U58.1(A3) U59.1(A3) ; also sheet 3
CPU_ADDR_B0: U58.17(B0) U59.17(B0) ; also sheet 2,3
CPU_ADDR_B1: U58.18(B1) U59.18(B1) ; also sheet 2,3
CPU_ADDR_B2: U58.19(B2) U59.19(B2) ; also sheet 2,3
CPU_ADDR_B3: U58.20(B3) U59.20(B3) ; also sheet 3
CPU_CLK: U58.15(CP) U59.15(CP) ; also sheet 2
CPU_F=0: R3.1 U58.11(F=0) U59.11(F=0)
CPU_I0: U58.12(I0) U59.12(I0)
CPU_I1: U58.13(I1) U59.13(I1)
CPU_I2: U58.14(I2) U59.14(I2)
CPU_I3: U58.26(I3) U59.26(I3)
CPU_I4: U58.28(I4) U59.28(I4)
CPU_I5: U58.27(I5) U59.27(I5)
CPU_I6: U58.5(I6) U59.5(I6)
CPU_I7: U58.7(I7) U59.7(I7)
CPU_I8: U58.6(I8) U59.6(I8)
CPU_U58-D0: U58.25(D0) ; also sheet 2,3
CPU_U58-D1: U58.24(D1) ; also sheet 2,3
CPU_U58-D2: U58.23(D2) ; also sheet 2,3
CPU_U58-D3: U58.22(D3) ; also sheet 2,3
CPU_U58-Y0: U58.36(Y0) U68.5(R0) ; also sheet 3
CPU_U58-Y1: U58.37(Y1) U68.4(R1) ; also sheet 3
CPU_U58-Y2: U58.38(Y2) U68.3(R2) ; also sheet 3
CPU_U58-Y3: U58.39(Y3) U68.2(R3) ; also sheet 3
CPU_U59-D0: U59.25(D0) ; also sheet 2
CPU_U59-D1: U59.24(D1) ; also sheet 2
CPU_U59-D2: U59.23(D2) ; also sheet 2
CPU_U59-D3: U59.22(D3) ; also sheet 2
CPU_U59-Y0: U59.36(Y0) U67.5(R0) ; also sheet 3
CPU_U59-Y1: U59.37(Y1) U67.4(R1) ; also sheet 3
CPU_U59-Y2: U59.38(Y2) U67.3(R2) ; also sheet 3
CPU_U59-Y3: U59.39(Y3) U67.2(R3) ; also sheet 3
GND: U67.6(OR3) U67.8(OR2) U67.10(OR1) U67.12(OR0) U68.6(OR3) U68.8(OR2) U68.10(OR1) U68.12(OR0) ; also sheet 1,2,3,5
N$1: U67.21(Y3)
SEQ_U67_!RE: U67.1(!RE) ; also sheet 2
SEQ_U67_D0: U67.13(D0) ; also sheet 3
SEQ_U67_D1: U67.11(D1) ; also sheet 3
SEQ_U67_D2: U67.9(D2) ; also sheet 3
SEQ_U67_D3: U67.7(D3) ; also sheet 3
SEQ_U68_D0: U68.13(D0) ; also sheet 3
SEQ_U68_D1: U68.11(D1) ; also sheet 3
SEQ_U68_D2: U68.9(D2) ; also sheet 3
SEQ_U68_D3: U68.7(D3) ; also sheet 3
U58-Q0_U59_Q3: U58.21(Q0) U59.16(Q3)
U58-RAM0_U59_RAM3: U58.9(RAM0) U59.8(RAM3)
U58_CN+4-U59_CN: U58.33(CN+4) U59.29(CN)
Unconnected: U58.8(RAM3) U58.16(Q3) U58.29(CN) U58.31(F3) U58.32(!G) U58.34(OVR) U58.35(!P) U59.9(RAM0) U59.21(Q0) U59.31(F3) U59.32(!G) U59.33(CN+4) U59.34(OVR) U59.35(!P) U67.15(!ZERO) U67.16(S0) U67.17(S1) U67.18(Y0) U67.19(Y1) U67.20(Y2) U67.22(!OE) U67.23(CN) U67.24(CN+4) U67.25(!FE) U67.26(PUP) U67.27(CP) U68.1(!RE) U68.15(!ZERO) U68.16(S0) U68.17(S1) U68.18(Y0) U68.19(Y1) U68.20(Y2) U68.21(Y3) U68.22(!OE) U68.23(CN) U68.24(CN+4) U68.25(!FE) U68.26(PUP) U68.27(CP)

## Sheet 5 of 5: Memory
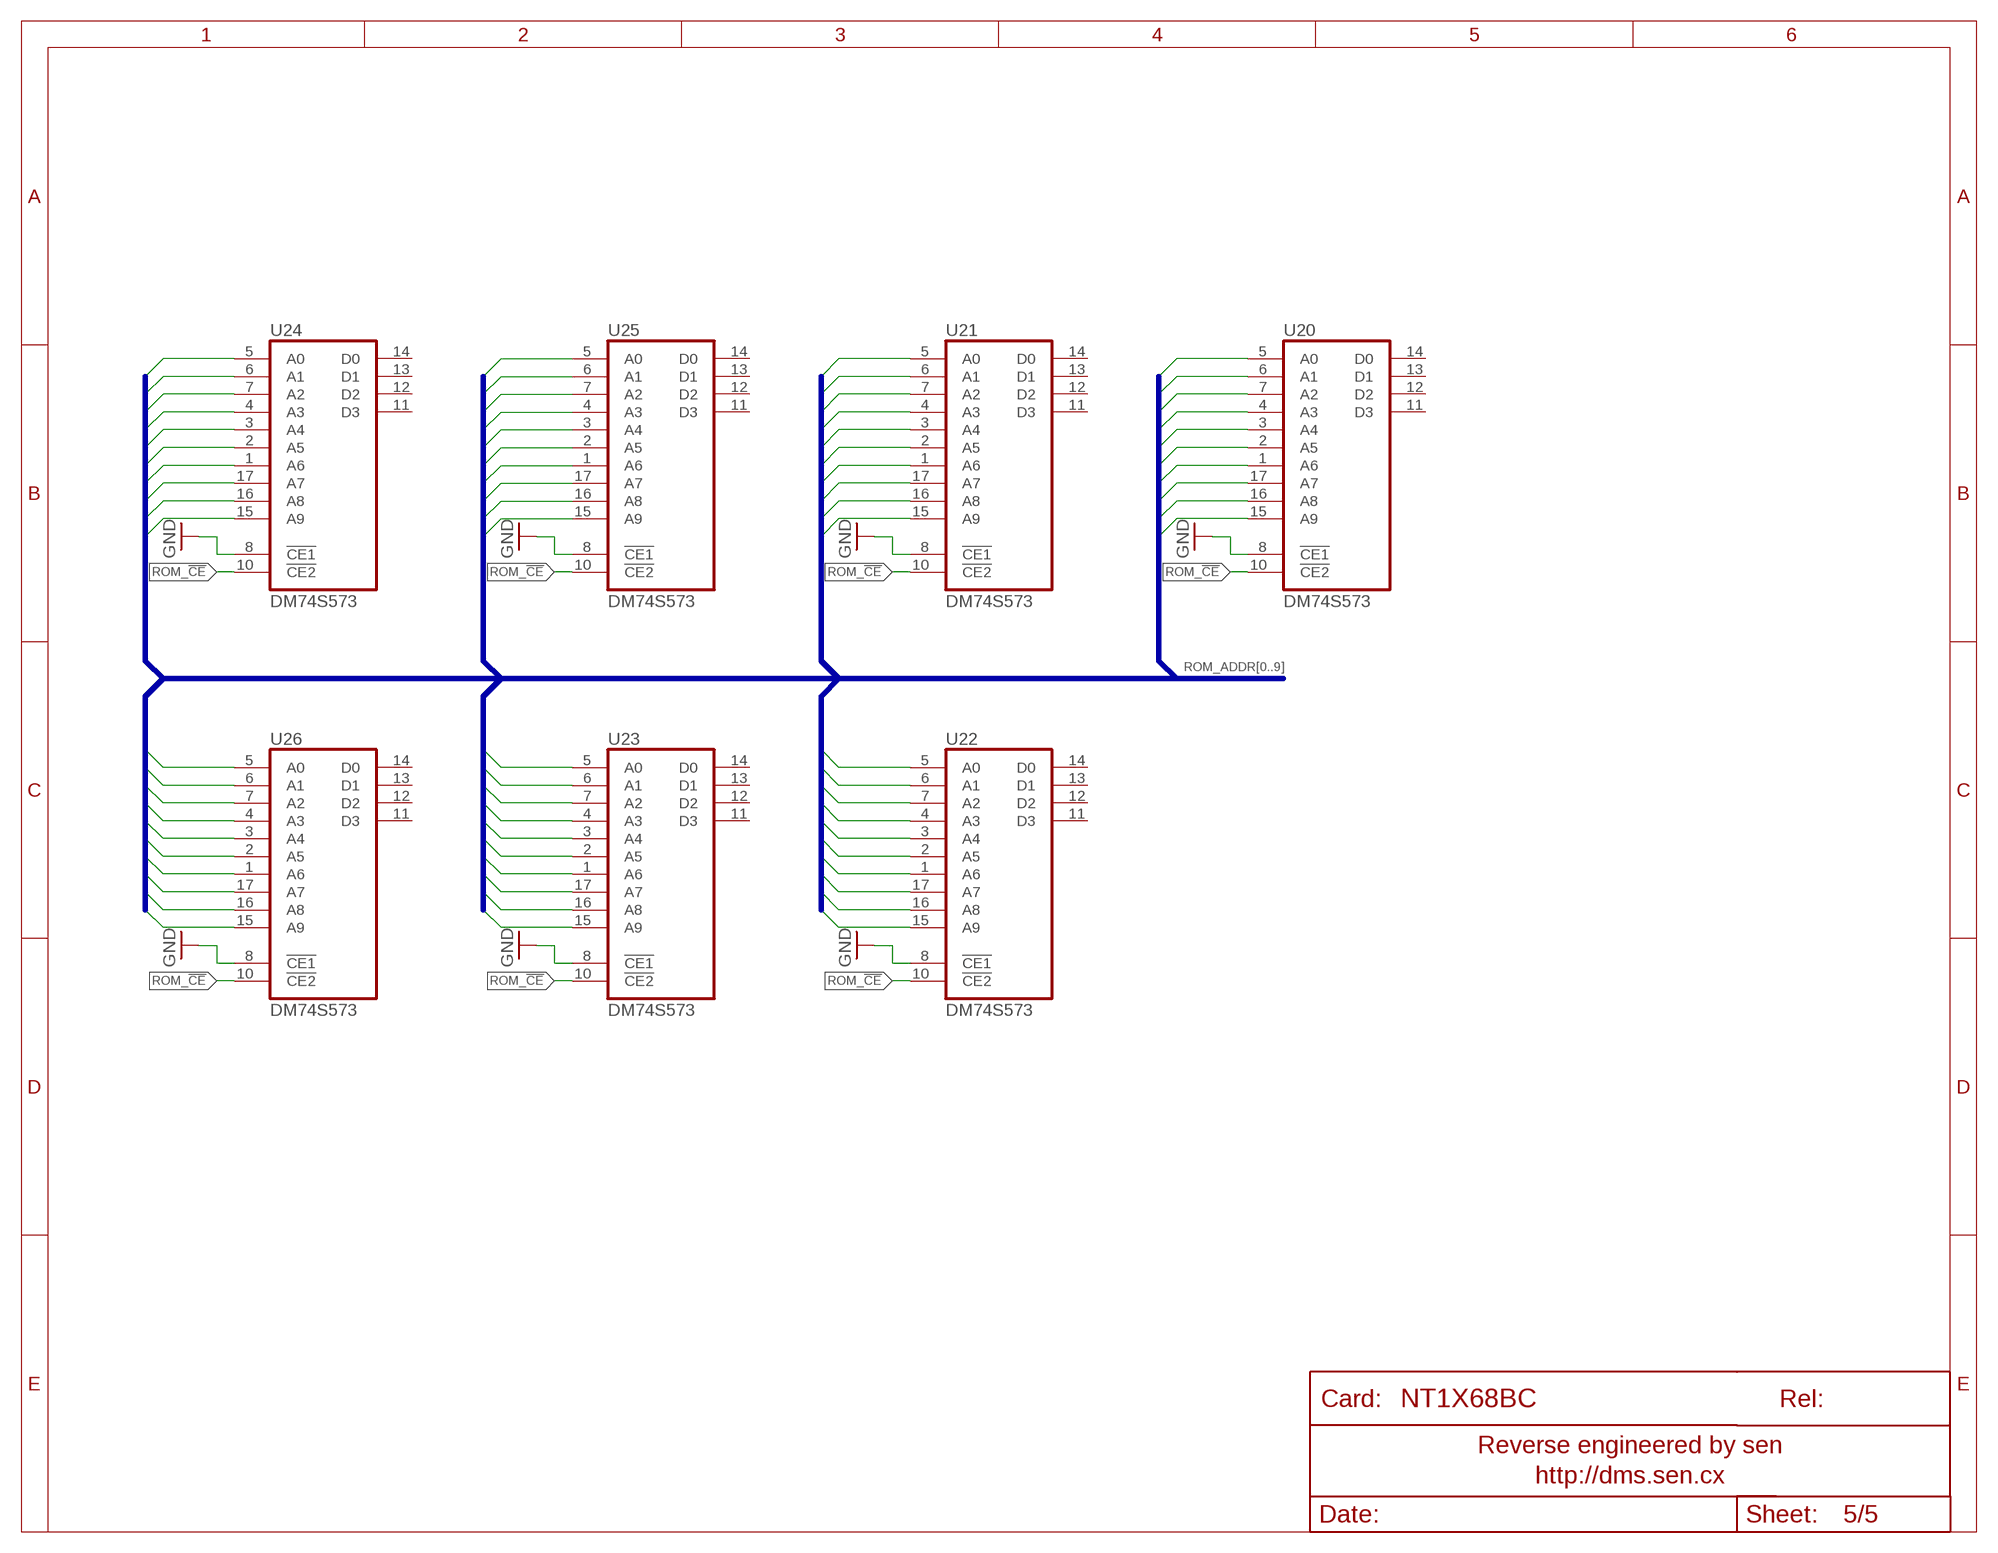
[diagram p4: schematic, sheet 5]
FRAME5 (FRAME-LETTER-GRID-DMS): REL: 04

### Nets
GND: U20.8(!CE1) U21.8(!CE1) U22.8(!CE1) U23.8(!CE1) U24.8(!CE1) U25.8(!CE1) U26.8(!CE1) ; also sheet 1,2,3,4
ROM_!CE: U20.10(!CE2) U21.10(!CE2) U22.10(!CE2) U23.10(!CE2) U24.10(!CE2) U25.10(!CE2) U26.10(!CE2)
ROM_ADDR0: U20.5(A0) U21.5(A0) U22.5(A0) U23.5(A0) U24.5(A0) U25.5(A0) U26.5(A0)
ROM_ADDR1: U20.6(A1) U21.6(A1) U22.6(A1) U23.6(A1) U24.6(A1) U25.6(A1) U26.6(A1)
ROM_ADDR2: U20.7(A2) U21.7(A2) U22.7(A2) U23.7(A2) U24.7(A2) U25.7(A2) U26.7(A2)
ROM_ADDR3: U20.4(A3) U21.4(A3) U22.4(A3) U23.4(A3) U24.4(A3) U25.4(A3) U26.4(A3)
ROM_ADDR4: U20.3(A4) U21.3(A4) U22.3(A4) U23.3(A4) U24.3(A4) U25.3(A4) U26.3(A4)
ROM_ADDR5: U20.2(A5) U21.2(A5) U22.2(A5) U23.2(A5) U24.2(A5) U25.2(A5) U26.2(A5)
ROM_ADDR6: U20.1(A6) U21.1(A6) U22.1(A6) U23.1(A6) U24.1(A6) U25.1(A6) U26.1(A6)
ROM_ADDR7: U20.17(A7) U21.17(A7) U22.17(A7) U23.17(A7) U24.17(A7) U25.17(A7) U26.17(A7)
ROM_ADDR8: U20.16(A8) U21.16(A8) U22.16(A8) U23.16(A8) U24.16(A8) U25.16(A8) U26.16(A8)
ROM_ADDR9: U20.15(A9) U21.15(A9) U22.15(A9) U23.15(A9) U24.15(A9) U25.15(A9) U26.15(A9)
Unconnected: U20.11(D3) U20.12(D2) U20.13(D1) U20.14(D0) U21.11(D3) U21.12(D2) U21.13(D1) U21.14(D0) U22.11(D3) U22.12(D2) U22.13(D1) U22.14(D0) U23.11(D3) U23.12(D2) U23.13(D1) U23.14(D0) U24.11(D3) U24.12(D2) U24.13(D1) U24.14(D0) U25.11(D3) U25.12(D2) U25.13(D1) U25.14(D0) U26.11(D3) U26.12(D2) U26.13(D1) U26.14(D0)

### Buses
ROM_ADDR[0..9]

## Library data of the parts
C5 C6 C15-C17 C19 C21-C24 C26 C28 C31-C34 C36 C41 C47 C53 C54 = rcl:C-US: CAPACITOR, American symbol
DS1 = led:LED: LED OSRAM: - CHIPLED LG R971, LG N971, LY N971, LG Q971, LY Q971, LO R971, LY R971 LH N974, LH R974 LS Q976, LO Q976, LY Q976 LO Q996 - Hyper CHIPLED LW Q18S LB Q993, LB Q99A, LB R99A - SideLED LS A670, LO A670, LY A670, LG A670, LP A670 LB A673, LV A673, LT A673, LW A673 LH A674 LY A675 LS A676, LA A676, LO A676, LY A676, LW A676 LS A679, LY A679, LG A679 - Hyper Micro SIDELED® LS Y876, LA Y876, LO Y876, LY Y876 LT Y87S - SmartLED LW L88C, LW L88S LB L89C, LB L89S, LG L890 LS L89K, LO L89K, LY L89K LS L896, LA L896, LO L896, LY L896 - TOPLED LS T670, LO T670, LY T670, LG T670, LP T670 LSG T670, LSP T670, LSY T670, LOP T670, LYG T670 LG T671, LOG T671, LSG T671 LB T673, LV T673, LT T673, LW T673 LH T674 LS T676, LA T676, LO T676, LY T676, LB T676, LH T676, LSB T676, LW T676 LB T67C, LV T67C, LT T67C, LS T67K, LO T67K, LY T67K, LW E67C LS E67B, LA E67B, LO E67B, LY E67B, LB E67C, LV E67C, LT E67C LW T67C LS T679, LY T679, LG T679 LS T770, LO T770, LY T770, LG T770, LP T770 LB T773, LV T773, LT T773, LW T773 LH T774 LS E675, LA E675, LY E675, LS T675 LS T776, LA T776, LO T776, LY T776, LB T776 LHGB T686 LT T68C, LB T68C - Hyper Mini TOPLED® LB M676 - Mini TOPLED Santana® LG M470 LS M47K, LO M47K, LY M47K Source: http://www.osram.convergy.de LUXEON: - LUMILED® LXK2-PW12-R00, LXK2-PW12-S00, LXK2-PW14-U00, LXK2-PW14-V00 LXK2-PM12-R00, LXK2-PM12-S00, LXK2-PM14-U00 LXK2-PE12-Q00, LXK2-PE12-R00, LXK2-PE12-S00, LXK2-PE14-T00, LXK2-PE14-U00 LXK2-PB12-K00, LXK2-PB12-L00, LXK2-PB12-M00, LXK2-PB14-N00, LXK2-PB14-P00, LXK2-PB14-Q00 LXK2-PR12-L00, LXK2-PR12-M00, LXK2-PR14-Q00, LXK2-PR14-R00 LXK2-PD12-Q00, LXK2-PD12-R00, LXK2-PD12-S00 LXK2-PH12-R00, LXK2-PH12-S00 LXK2-PL12-P00, LXK2-PL12-Q00, LXK2-PL12-R00 Source: www.luxeon.com KINGBRIGHT: KA-3528ASYC Source: www.kingbright.com
F1 = fuse:LITTLEFUSE: LITTLEFUSE Picofuse/slow Littlefuse; OC_FARNELL: unknown; OC_NEWARK: unknown
P1 = dms-connector:FE80-2W-HALFKEY: FEMALE HEADER Used for backplane on IOC Shelf, 2 40x2 segments with a key between.; OC_FARNELL: unknown; OC_NEWARK: unknown
R1 R3 R13 R15 R17-R19 R21 R22 = rcl:R-US_: RESISTOR, American symbol
RN1 RN2 = dms-rcl:DALE-MDP1605: 14-resistor dual-rail termination network
U5 = 74xx-us:74*14: Hex schmitt trigger INVERTER
U7 U39 U40 = 74xx-us:74*374: Octal D type transparent LATCH, edge triggered
U20-U26 = dms-natsemi:DM74S573: MEMORY
U27 U28 = 74xx-us:74*136: Quad EXCLUSIV-OR/NOR (XOR/NOR) gate, open collector
U30-U32 U34 = 74xx-us:74*257: Quadruple 2-to 1 line data SELECTOR/MULTIPLEXER
U43-U46 = 74xx-us:74*240: Octal BUFFER and LINE DRIVER, 3-state
U49 = 74xx-us:74*109: Dual J-K positive edge triggered FLIP FLOP, preset and clear
U53 = 74xx-us:74*138: 3-line to 8-line DECODER/DEMULTIPLEXER
U56 U57 = 74xx-us:74*280: 9-bit odd/even PARITY GENERATOR/CHECKER
U58 U59 = dms-cypress:CY7C901: 4-bit bit-slice CPU
U60 = 74xx-us:74*241: Octal BUFFER and LINE DRIVER, 3-state
U67 U68 = dms-cypress:CY7C909: 4-bit bit-slice microprogram sequencer